# EAGLE design Mixer_Module (EAGLE 7.6.0)

## Sheet 1 of 4
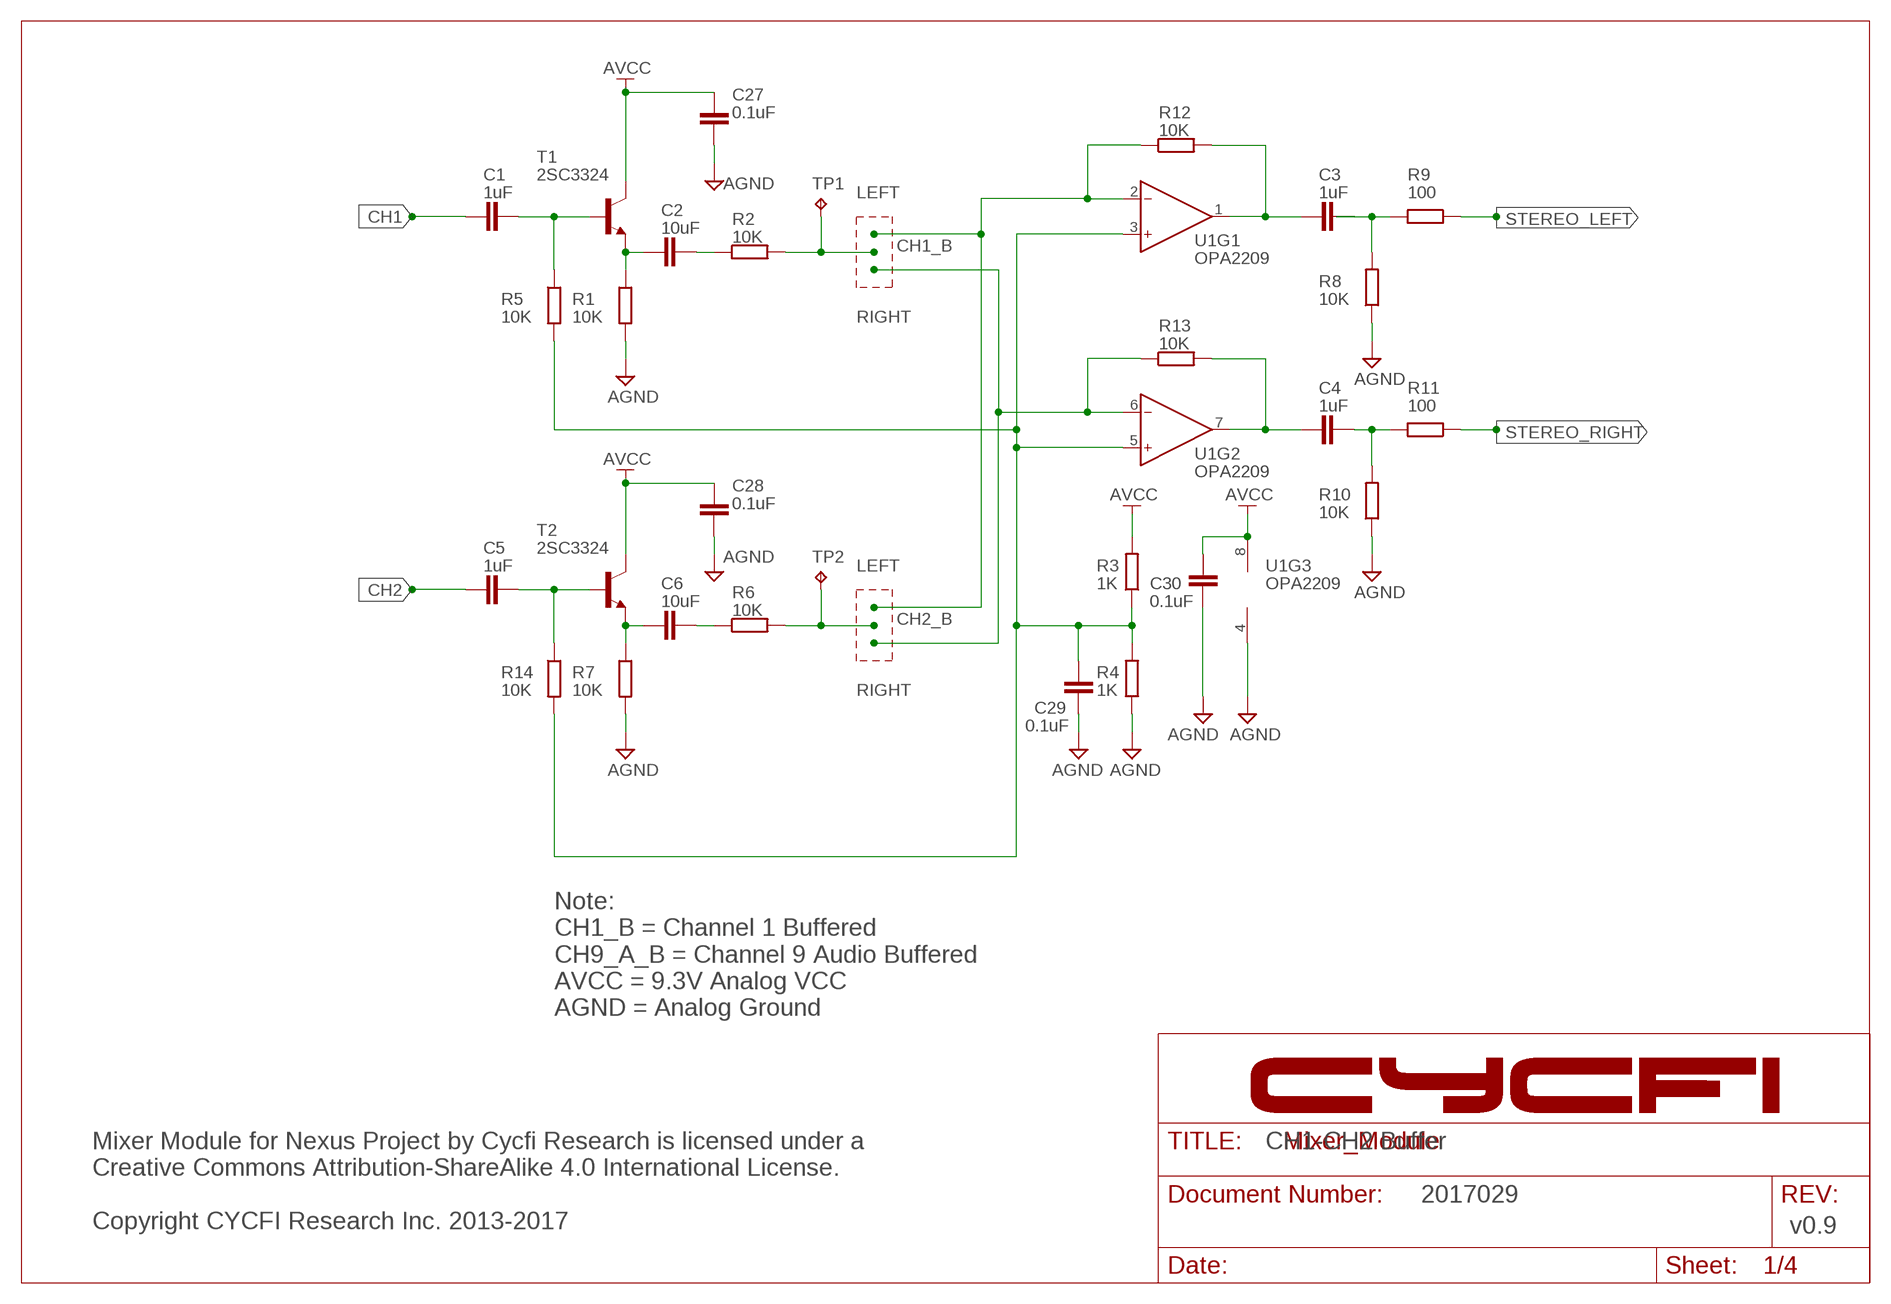
[diagram p0: schematic, sheet 1]

### Parts
C1  1uF  C-EUC0603  [C0603]
C2  10uF  C-EUC0603  [C0603]
C3  1uF  C-EUC0603  [C0603]
C4  1uF  C-EUC0603  [C0603]
C5  1uF  C-EUC0603  [C0603]
C6  10uF  C-EUC0603  [C0603]
C27  0.1uF  C-EUC0603  [C0603]
C28  0.1uF  C-EUC0603  [C0603]
C29  0.1uF  C-EUC0603  [C0603]
C30  0.1uF  C-EUC0603  [C0603]
R1  10K  R-EU_R0402  [R0402]
R2  10K  R-EU_R0402  [R0402]
R3  1K  R-EU_R0402  [R0402]
R4  1K  R-EU_R0402  [R0402]
R5  10K  R-EU_R0402  [R0402]
R6  10K  R-EU_R0402  [R0402]
R7  10K  R-EU_R0402  [R0402]
R8  10K  R-EU_R0402  [R0402]
R9  100  R-EU_R0402  [R0402]
R10  10K  R-EU_R0402  [R0402]
R11  100  R-EU_R0402  [R0402]
R12  10K  R-EU_R0402  [R0402]
R13  10K  R-EU_R0402  [R0402]
R14  10K  R-EU_R0402  [R0402]
T1  2SC3324  [SOT23]
T2  2SC3324  [SOT23]
TP1  TPB1,27  [B1,27]
TP2  TPB1,27  [B1,27]
U1  OPA2209  [MSOP8]

### Nets
AGND: C27.1 C28.1 C29.1 C30.1 R1.2 R4.1 R7.2 R8.1 R10.1 U1.4(V-) ; also sheet 2,3,4
AVCC: C27.2 C28.2 C30.2 R3.2 T1.3(C) T2.3(C) U1.8(V+) ; also sheet 2,3
CH1: C1.1 ; also sheet 4
CH1_B: R2.2 TP1.TP ; also sheet 4
CH2: C5.1 ; also sheet 4
CH2_B: R6.2 TP2.TP ; also sheet 4
LEFT: R12.1 U1.2(IN-) ; also sheet 2,4
N$1: C6.1 R7.1 T2.2(E)
N$2: C2.1 R1.1 T1.2(E)
N$3: C1.2 R5.1 T1.1(B)
N$4: C3.2 R8.2 R9.2
N$5: C3.1 R12.2 U1.1(OUT)
N$6: C4.1 R13.2 U1.7(OUT)
N$7: C2.2 R2.1
N$8: C4.2 R10.2 R11.2
N$9: C6.2 R6.1
N$10: C5.2 R14.1 T2.1(B)
N$11: C29.2 R3.1 R4.2 R5.2 R14.2 U1.3(IN+) U1.5(IN+)
RIGHT: R13.1 U1.6(IN-) ; also sheet 2,4
STEREO_LEFT: R9.1 ; also sheet 4
STEREO_RIGHT: R11.1 ; also sheet 4

### Notes on the sheet
- Note:
  CH1_B = Channel 1 Buffered
  CH9_A_B = Channel 9 Audio Buffered
  AVCC = 9.3V Analog VCC
  AGND = Analog Ground
- CH1-CH2 Buffer
- 2017029
- Mixer Module for Nexus Project by Cycfi Research is licensed under a 
  Creative Commons Attribution-ShareAlike 4.0 International License. 
  
  Copyright CYCFI Research Inc. 2013-2017
- v0.9

## Sheet 2 of 4
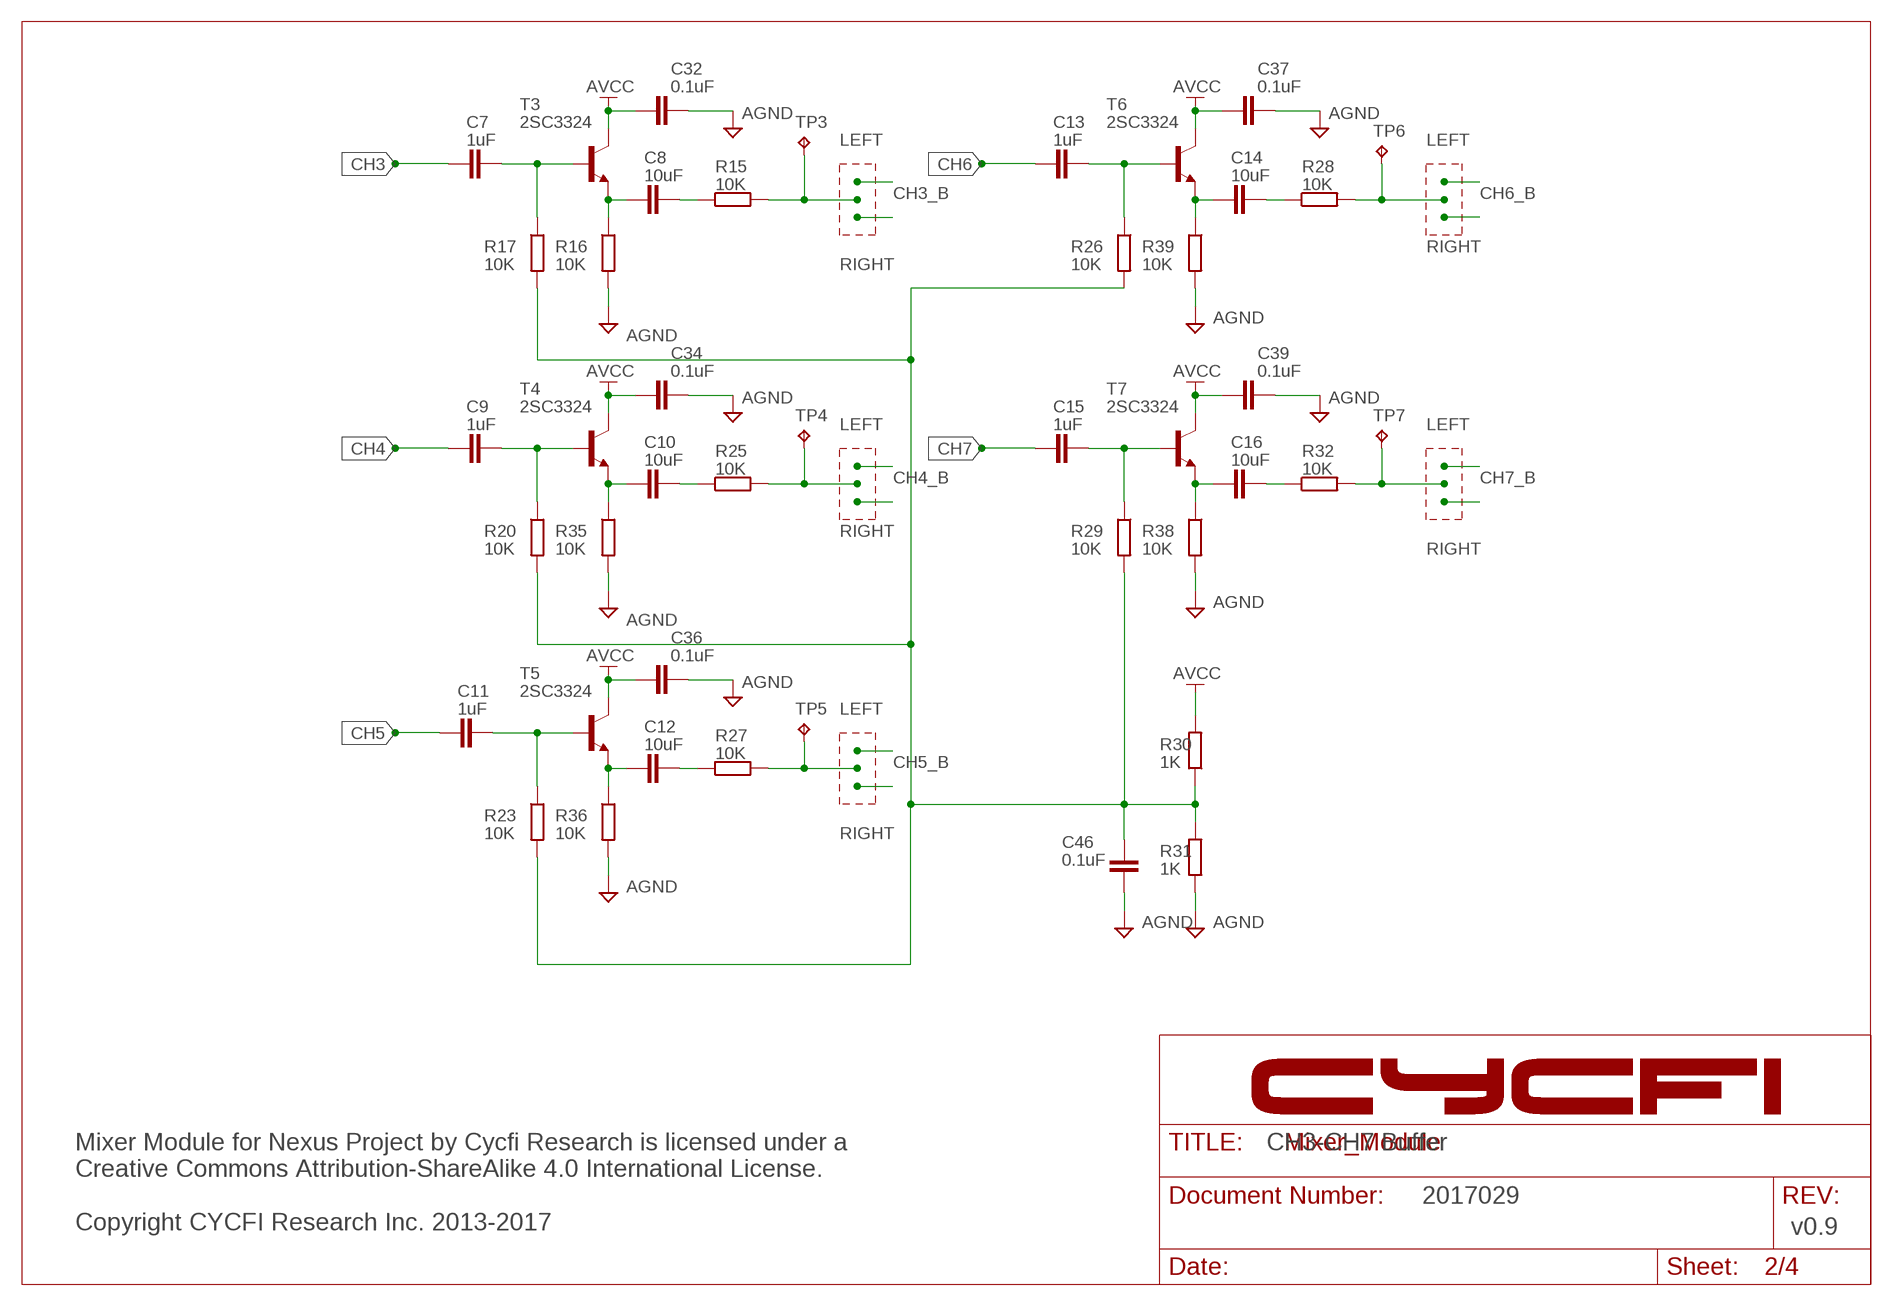
[diagram p1: schematic, sheet 2, part 1 of 2]
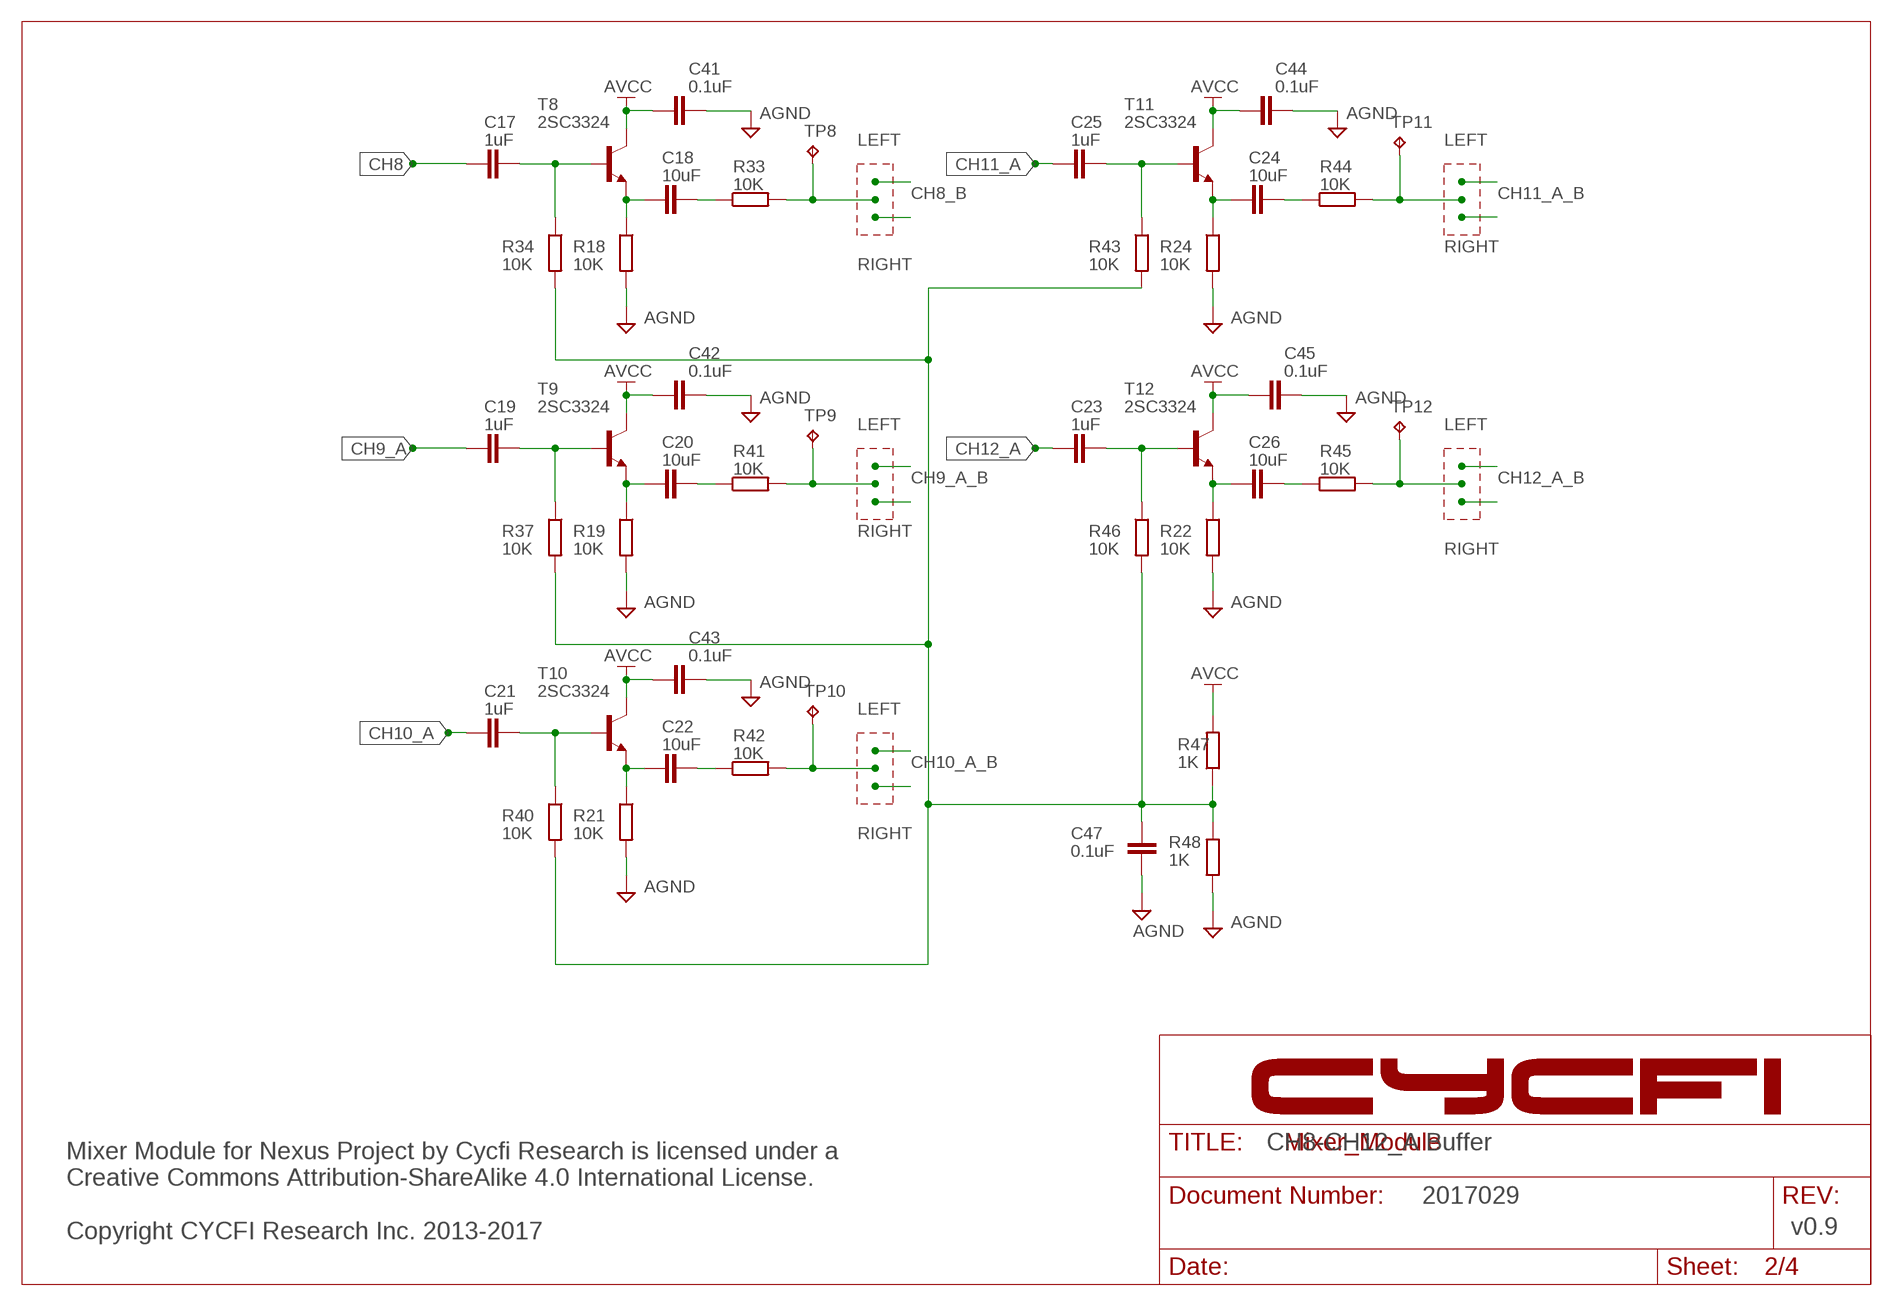
[diagram p2: schematic, sheet 2, part 2 of 2]

### Parts
C7  1uF  C-EUC0603  [C0603]
C8  10uF  C-EUC0603  [C0603]
C9  1uF  C-EUC0603  [C0603]
C10  10uF  C-EUC0603  [C0603]
C11  1uF  C-EUC0603  [C0603]
C12  10uF  C-EUC0603  [C0603]
C13  1uF  C-EUC0603  [C0603]
C14  10uF  C-EUC0603  [C0603]
C15  1uF  C-EUC0603  [C0603]
C16  10uF  C-EUC0603  [C0603]
C17  1uF  C-EUC0603  [C0603]
C18  10uF  C-EUC0603  [C0603]
C19  1uF  C-EUC0603  [C0603]
C20  10uF  C-EUC0603  [C0603]
C21  1uF  C-EUC0603  [C0603]
C22  10uF  C-EUC0603  [C0603]
C23  1uF  C-EUC0603  [C0603]
C24  10uF  C-EUC0603  [C0603]
C25  1uF  C-EUC0603  [C0603]
C26  10uF  C-EUC0603  [C0603]
C32  0.1uF  C-EUC0603  [C0603]
C34  0.1uF  C-EUC0603  [C0603]
C36  0.1uF  C-EUC0603  [C0603]
C37  0.1uF  C-EUC0603  [C0603]
C39  0.1uF  C-EUC0603  [C0603]
C41  0.1uF  C-EUC0603  [C0603]
C42  0.1uF  C-EUC0603  [C0603]
C43  0.1uF  C-EUC0603  [C0603]
C44  0.1uF  C-EUC0603  [C0603]
C45  0.1uF  C-EUC0603  [C0603]
C46  0.1uF  C-EUC0603  [C0603]
C47  0.1uF  C-EUC0603  [C0603]
R15  10K  R-EU_R0402  [R0402]
R16  10K  R-EU_R0402  [R0402]
R17  10K  R-EU_R0402  [R0402]
R18  10K  R-EU_R0402  [R0402]
R19  10K  R-EU_R0402  [R0402]
R20  10K  R-EU_R0402  [R0402]
R21  10K  R-EU_R0402  [R0402]
R22  10K  R-EU_R0402  [R0402]
R23  10K  R-EU_R0402  [R0402]
R24  10K  R-EU_R0402  [R0402]
R25  10K  R-EU_R0402  [R0402]
R26  10K  R-EU_R0402  [R0402]
R27  10K  R-EU_R0402  [R0402]
R28  10K  R-EU_R0402  [R0402]
R29  10K  R-EU_R0402  [R0402]
R30  1K  R-EU_R0402  [R0402]
R31  1K  R-EU_R0402  [R0402]
R32  10K  R-EU_R0402  [R0402]
R33  10K  R-EU_R0402  [R0402]
R34  10K  R-EU_R0402  [R0402]
R35  10K  R-EU_R0402  [R0402]
R36  10K  R-EU_R0402  [R0402]
R37  10K  R-EU_R0402  [R0402]
R38  10K  R-EU_R0402  [R0402]
R39  10K  R-EU_R0402  [R0402]
R40  10K  R-EU_R0402  [R0402]
R41  10K  R-EU_R0402  [R0402]
R42  10K  R-EU_R0402  [R0402]
R43  10K  R-EU_R0402  [R0402]
R44  10K  R-EU_R0402  [R0402]
R45  10K  R-EU_R0402  [R0402]
R46  10K  R-EU_R0402  [R0402]
R47  1K  R-EU_R0402  [R0402]
R48  1K  R-EU_R0402  [R0402]
T3  2SC3324  [SOT23]
T4  2SC3324  [SOT23]
T5  2SC3324  [SOT23]
T6  2SC3324  [SOT23]
T7  2SC3324  [SOT23]
T8  2SC3324  [SOT23]
T9  2SC3324  [SOT23]
T10  2SC3324  [SOT23]
T11  2SC3324  [SOT23]
T12  2SC3324  [SOT23]
TP3  TPB1,27  [B1,27]
TP4  TPB1,27  [B1,27]
TP5  TPB1,27  [B1,27]
TP6  TPB1,27  [B1,27]
TP7  TPB1,27  [B1,27]
TP8  TPB1,27  [B1,27]
TP9  TPB1,27  [B1,27]
TP10  TPB1,27  [B1,27]
TP11  TPB1,27  [B1,27]
TP12  TPB1,27  [B1,27]

### Nets
AGND: C32.1 C34.1 C36.1 C37.1 C39.1 C41.1 C42.1 C43.1 C44.1 C45.1 C46.1 C47.1 R16.2 R18.2 R19.2 R21.2 R22.2 R24.2 R31.1 R35.2 R36.2 R38.2 R39.2 R48.1 ; also sheet 1,3,4
AVCC: C32.2 C34.2 C36.2 C37.2 C39.2 C41.2 C42.2 C43.2 C44.2 C45.2 R30.2 R47.2 T3.3(C) T4.3(C) T5.3(C) T6.3(C) T7.3(C) T8.3(C) T9.3(C) T10.3(C) T11.3(C) T12.3(C) ; also sheet 1,3
CH3: C7.1 ; also sheet 4
CH3_B: R15.2 TP3.TP ; also sheet 4
CH4: C9.1 ; also sheet 4
CH4_B: R25.2 TP4.TP ; also sheet 4
CH5: C11.1 ; also sheet 4
CH5_B: R27.2 TP5.TP ; also sheet 4
CH6: C13.1 ; also sheet 4
CH6_B: R28.2 TP6.TP ; also sheet 4
CH7: C15.1 ; also sheet 4
CH7_B: R32.2 TP7.TP ; also sheet 4
CH8: C17.1 ; also sheet 4
CH8_B: R33.2 TP8.TP ; also sheet 4
CH9_A: C19.1 ; also sheet 4
CH9_A_B: R41.2 TP9.TP ; also sheet 4
CH10_A: C21.1 ; also sheet 4
CH10_A_B: R42.2 TP10.TP ; also sheet 4
CH11_A: C25.1 ; also sheet 4
CH11_A_B: R44.2 TP11.TP ; also sheet 4
CH12_A: C23.1 ; also sheet 4
CH12_A_B: R45.2 TP12.TP ; also sheet 4
N$12: C18.1 R18.1 T8.2(E)
N$13: C18.2 R33.1
N$14: C8.1 R16.1 T3.2(E)
N$15: C8.2 R15.1
N$16: C7.2 R17.1 T3.1(B)
N$18: C10.1 R35.1 T4.2(E)
N$19: C10.2 R25.1
N$20: C9.2 R20.1 T4.1(B)
N$22: C12.1 R36.1 T5.2(E)
N$23: C12.2 R27.1
N$24: C11.2 R23.1 T5.1(B)
N$26: C14.1 R39.1 T6.2(E)
N$27: C14.2 R28.1
N$28: C13.2 R26.1 T6.1(B)
N$30: C16.1 R38.1 T7.2(E)
N$31: C16.2 R32.1
N$32: C15.2 R29.1 T7.1(B)
N$34: C46.2 R17.2 R20.2 R23.2 R26.2 R29.2 R30.1 R31.2
N$35: C17.2 R34.1 T8.1(B)
N$36: C20.1 R19.1 T9.2(E)
N$37: C20.2 R41.1
N$38: C19.2 R37.1 T9.1(B)
N$40: C22.1 R21.1 T10.2(E)
N$41: C22.2 R42.1
N$42: C21.2 R40.1 T10.1(B)
N$44: C24.1 R24.1 T11.2(E)
N$45: C24.2 R44.1
N$46: C25.2 R43.1 T11.1(B)
N$48: C26.1 R22.1 T12.2(E)
N$49: C26.2 R45.1
N$50: C23.2 R46.1 T12.1(B)
N$52: C47.2 R34.2 R37.2 R40.2 R43.2 R46.2 R47.1 R48.2

### Notes on the sheet
- CH3-CH7 Buffer | CH8-CH12_A Buffer
- 2017029 | 2017029
- Mixer Module for Nexus Project by Cycfi Research is licensed under a 
  Creative Commons Attribution-ShareAlike 4.0 International License. 
  
  Copyright CYCFI Research Inc. 2013-2017
- v0.9 | v0.9
- Mixer Module for Nexus Project by Cycfi Research is licensed under a 
  Creative Commons Attribution-ShareAlike 4.0 International License. 
  
  Copyright CYCFI Research Inc. 2013-2017

## Sheet 3 of 4
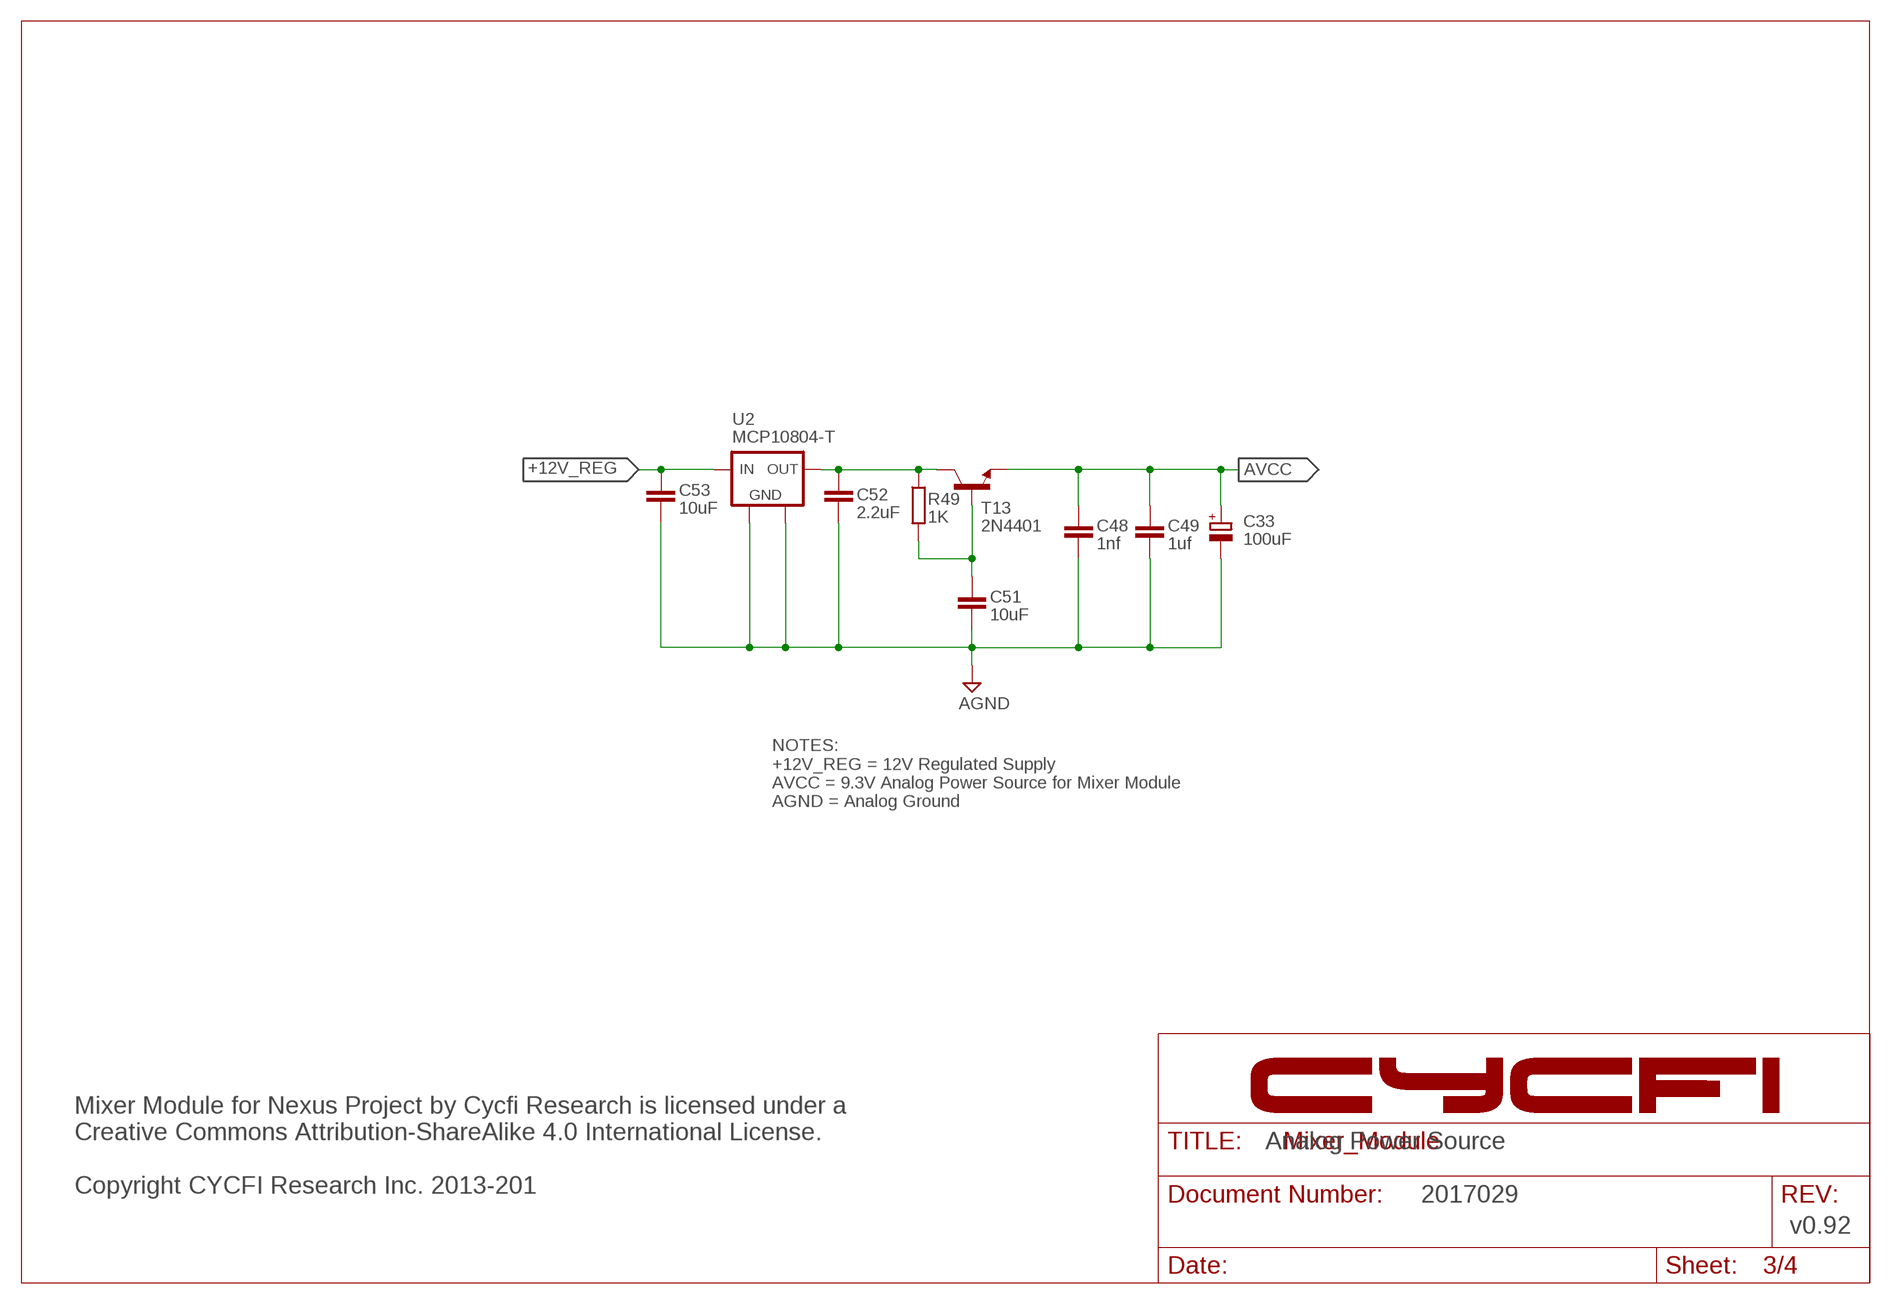
[diagram p3: schematic, sheet 3]

### Parts
C33  100uF  CPOL-EU153CLV-0505  [153CLV-0505]
C48  1nf  C-EUC0603  [C0603]
C49  1uf  C-EUC0603  [C0603]
C51  10uF  C-EUC0805  [C0805]
C52  2.2uF  C-EUC0805  [C0805]
C53  10uF  C-EUC0805  [C0805]
R49  1K  R-EU_R0402  [R0402]
T13  2N4401  TRAN-MMBT2222A  [SOT23-3]
U2  MCP10804-T  L78LXX  [SOT89]

### Nets
+12V_REG: C53.1 U2.3(OUT) ; also sheet 4
AGND: C33.- C48.2 C49.2 C51.2 C52.2 C53.2 U2.2(GND) U2.2@1(GND1) ; supply symbol labelled GND ; also sheet 1,2,4
AVCC: C33.+ C48.1 C49.1 T13.2(E) ; also sheet 1,2
N$29: C51.1 R49.2 T13.1(B)
N$33: C52.1 R49.1 T13.3(C) U2.1(IN)

### Notes on the sheet
- NOTES:
  +12V_REG = 12V Regulated Supply
  AVCC = 9.3V Analog Power Source for Mixer Module
  AGND = Analog Ground
- Analog Power Source
- Mixer Module for Nexus Project by Cycfi Research is licensed under a 
  Creative Commons Attribution-ShareAlike 4.0 International License. 
  
  Copyright CYCFI Research Inc. 2013-201
- 2017029
- v0.92

## Sheet 4 of 4
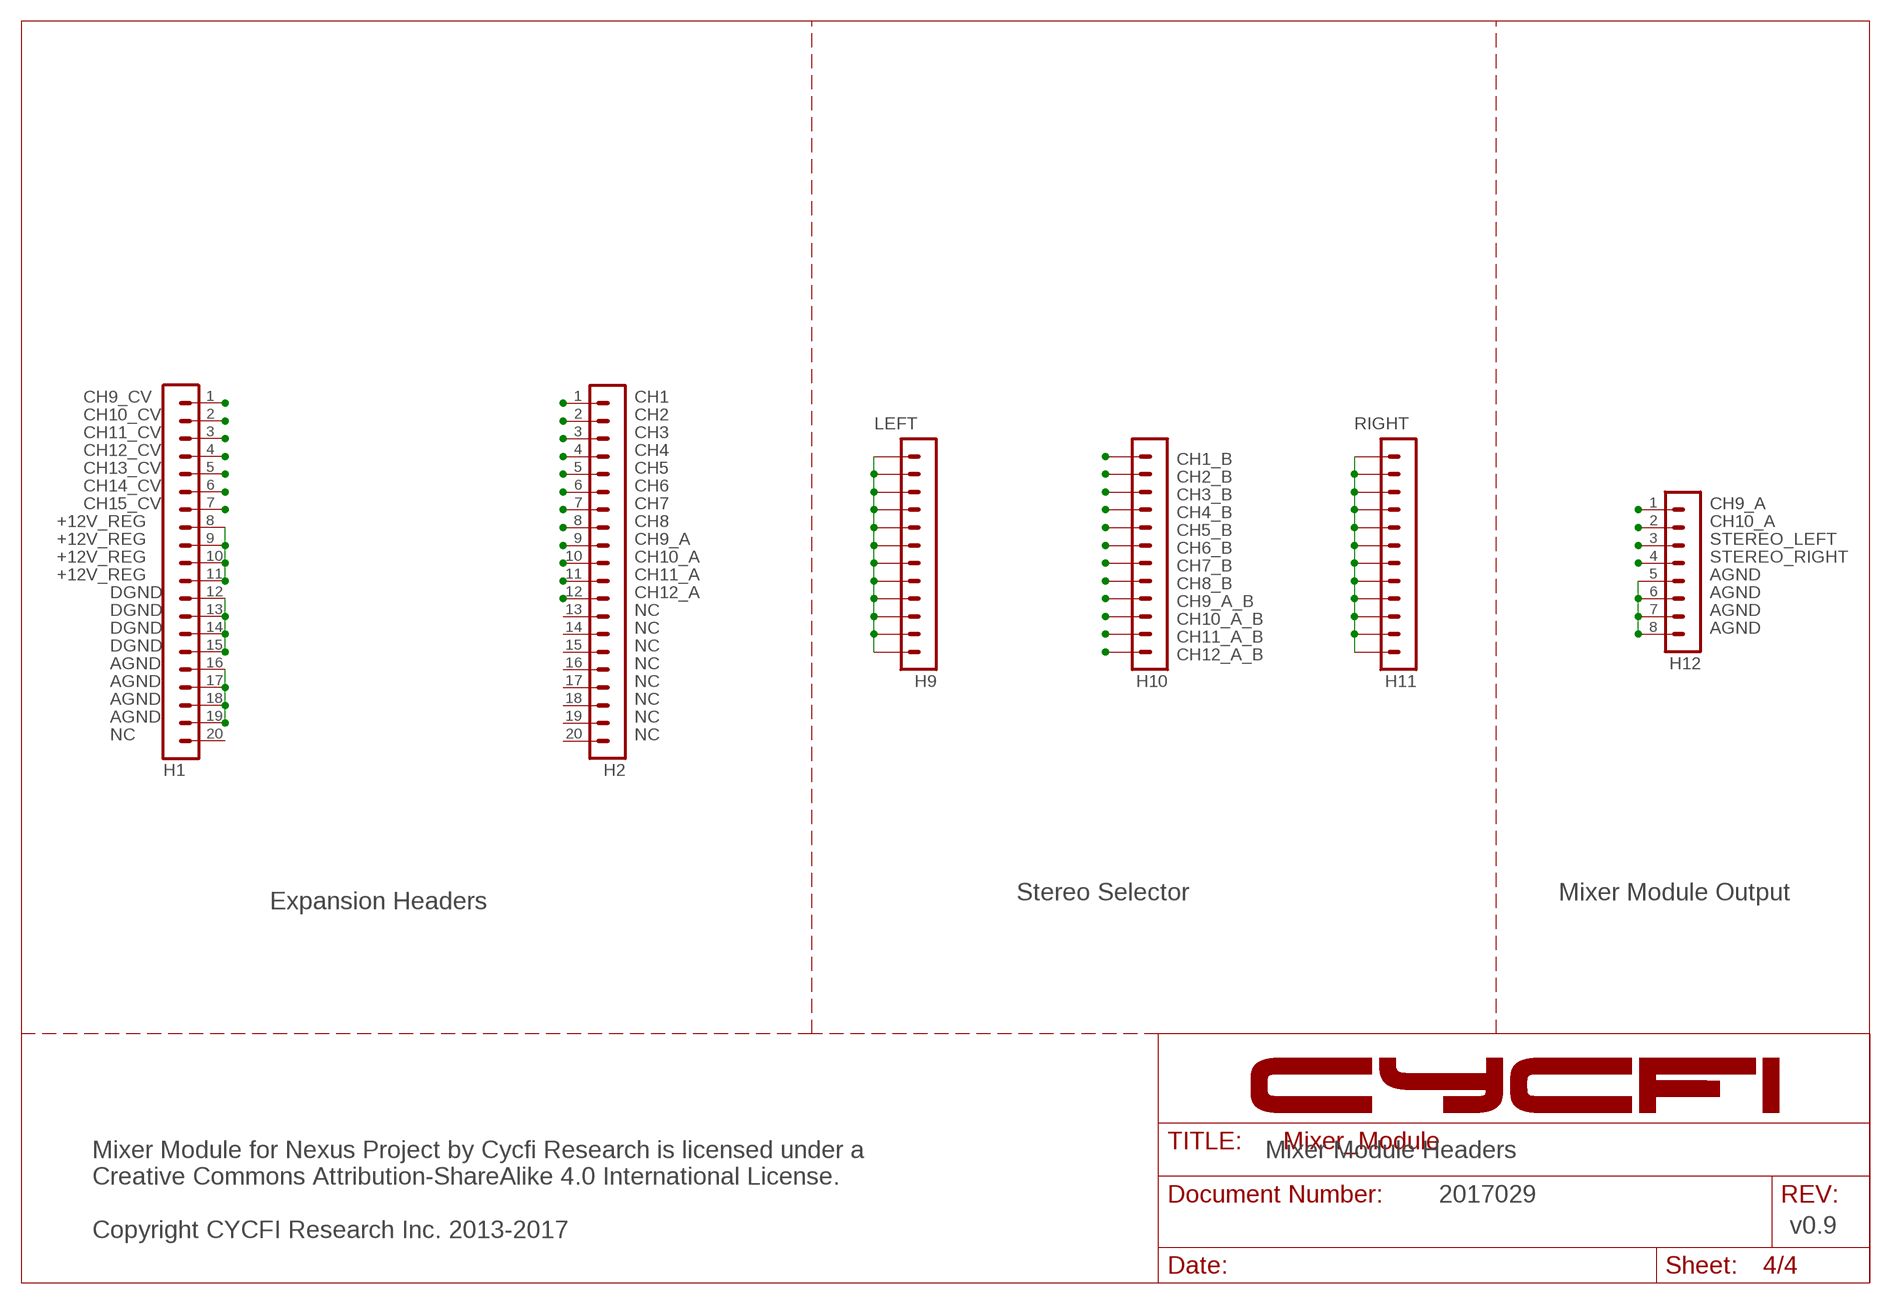
[diagram p4: schematic, sheet 4]

### Parts
H1  MA20-1  [MA20-1]
H2  MA20-1  [MA20-1]
H9  12PIN-TH-2.54MM  [12P]
H10  12PIN-TH-2.54MM  [12P]
H11  12PIN-TH-2.54MM  [12P]
H12  MA08-1  [MA08-1]

### Nets
+12V_REG: H1.8 H1.9 H1.10 H1.11 ; also sheet 3
AGND: H1.16 H1.17 H1.18 H1.19 H12.5 H12.6 H12.7 H12.8 ; also sheet 1,2,3
CH1: H2.1 ; also sheet 1
CH1_B: H10.1 ; also sheet 1
CH2: H2.2 ; also sheet 1
CH2_B: H10.2 ; also sheet 1
CH3: H2.3 ; also sheet 2
CH3_B: H10.3 ; also sheet 2
CH4: H2.4 ; also sheet 2
CH4_B: H10.4 ; also sheet 2
CH5: H2.5 ; also sheet 2
CH5_B: H10.5 ; also sheet 2
CH6: H2.6 ; also sheet 2
CH6_B: H10.6 ; also sheet 2
CH7: H2.7 ; also sheet 2
CH7_B: H10.7 ; also sheet 2
CH8: H2.8 ; also sheet 2
CH8_B: H10.8 ; also sheet 2
CH9_A: H2.9 H12.1 ; also sheet 2
CH9_A_B: H10.9 ; also sheet 2
CH10_A: H2.10 H12.2 ; also sheet 2
CH10_A_B: H10.10 ; also sheet 2
CH11_A: H2.11 ; also sheet 2
CH11_A_B: H10.11 ; also sheet 2
CH12_A: H2.12 ; also sheet 2
CH12_A_B: H10.12 ; also sheet 2
CH15_CV: H1.7
DGND: H1.12 H1.13 H1.14 H1.15
LEFT: H9.1 H9.2 H9.3 H9.4 H9.5 H9.6 H9.7 H9.8 H9.9 H9.10 H9.11 H9.12 ; also sheet 1,2
N$17: H1.1
N$39: H1.2
N$43: H1.3
N$47: H1.4
N$51: H1.5
N$53: H1.6
RIGHT: H11.1 H11.2 H11.3 H11.4 H11.5 H11.6 H11.7 H11.8 H11.9 H11.10 H11.11 H11.12 ; also sheet 1,2
STEREO_LEFT: H12.3 ; also sheet 1
STEREO_RIGHT: H12.4 ; also sheet 1
Unconnected: H1.20 H2.13 H2.14 H2.15 H2.16 H2.17 H2.18 H2.19 H2.20

### Notes on the sheet
- CH9_CV
- CH10_CV
- CH11_CV
- CH12_CV
- CH13_CV
- CH14_CV
- NC
- NC
- NC
- NC
- NC
- NC
- NC
- NC | NC
- Stereo Selector | Mixer Module Output
- Expansion Headers
- Mixer Module Headers
- 2017029
- v0.9
- Mixer Module for Nexus Project by Cycfi Research is licensed under a 
  Creative Commons Attribution-ShareAlike 4.0 International License. 
  
  Copyright CYCFI Research Inc. 2013-2017

## Library data of the parts
C1-C30 C32 C34 C36 C37 C39 C41-C49 C51-C53 = resistor:C-EU: CAPACITOR, European symbol
C33 = resistor:CPOL-EU: POLARIZED CAPACITOR, European symbol
H1 H2 = con-lstb:MA20-1: PIN HEADER; OC_FARNELL: unknown; OC_NEWARK: unknown
H9-H11 = CYCFI_Con:12PIN-TH-2.54MM
H12 = con-lstb:MA08-1: PIN HEADER; OC_FARNELL: unknown; OC_NEWARK: unknown
R1-R49 = resistor:R-EU_: RESISTOR, European symbol
T1-T12 = CYCFI_semicon:2SC3324
T13 = Cycfi:TRAN-MMBT2222A
TP1-TP12 = testpad:TP: Test pad
U1 = CYCFI_semicon:OPA2209
U2 = CYCFI_Power:L78LXX

## Board
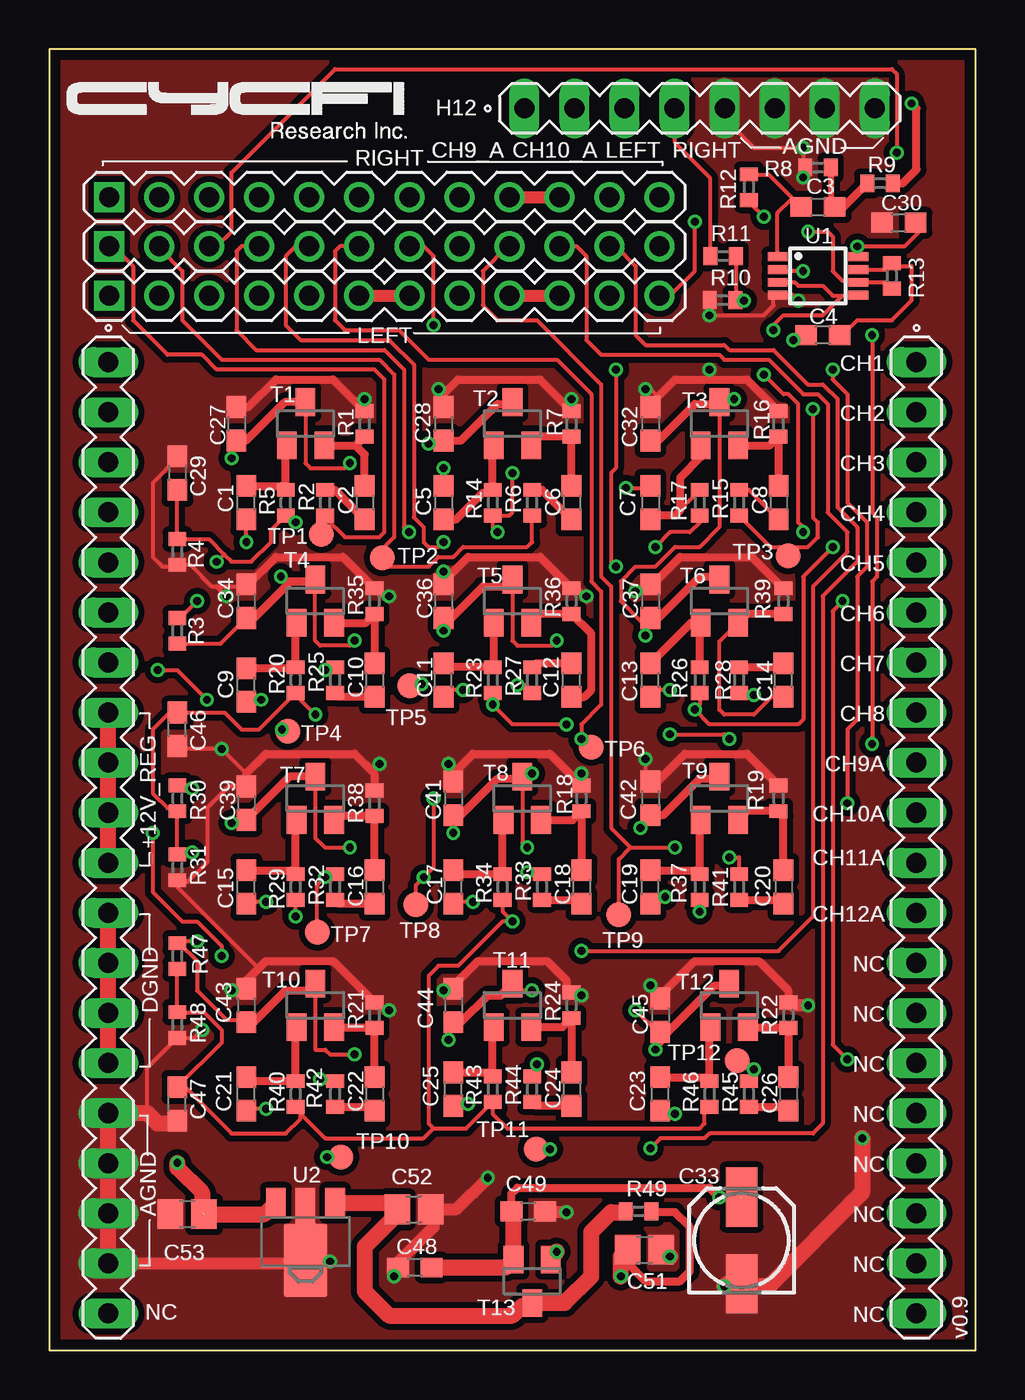
[diagram p5: board, top side]
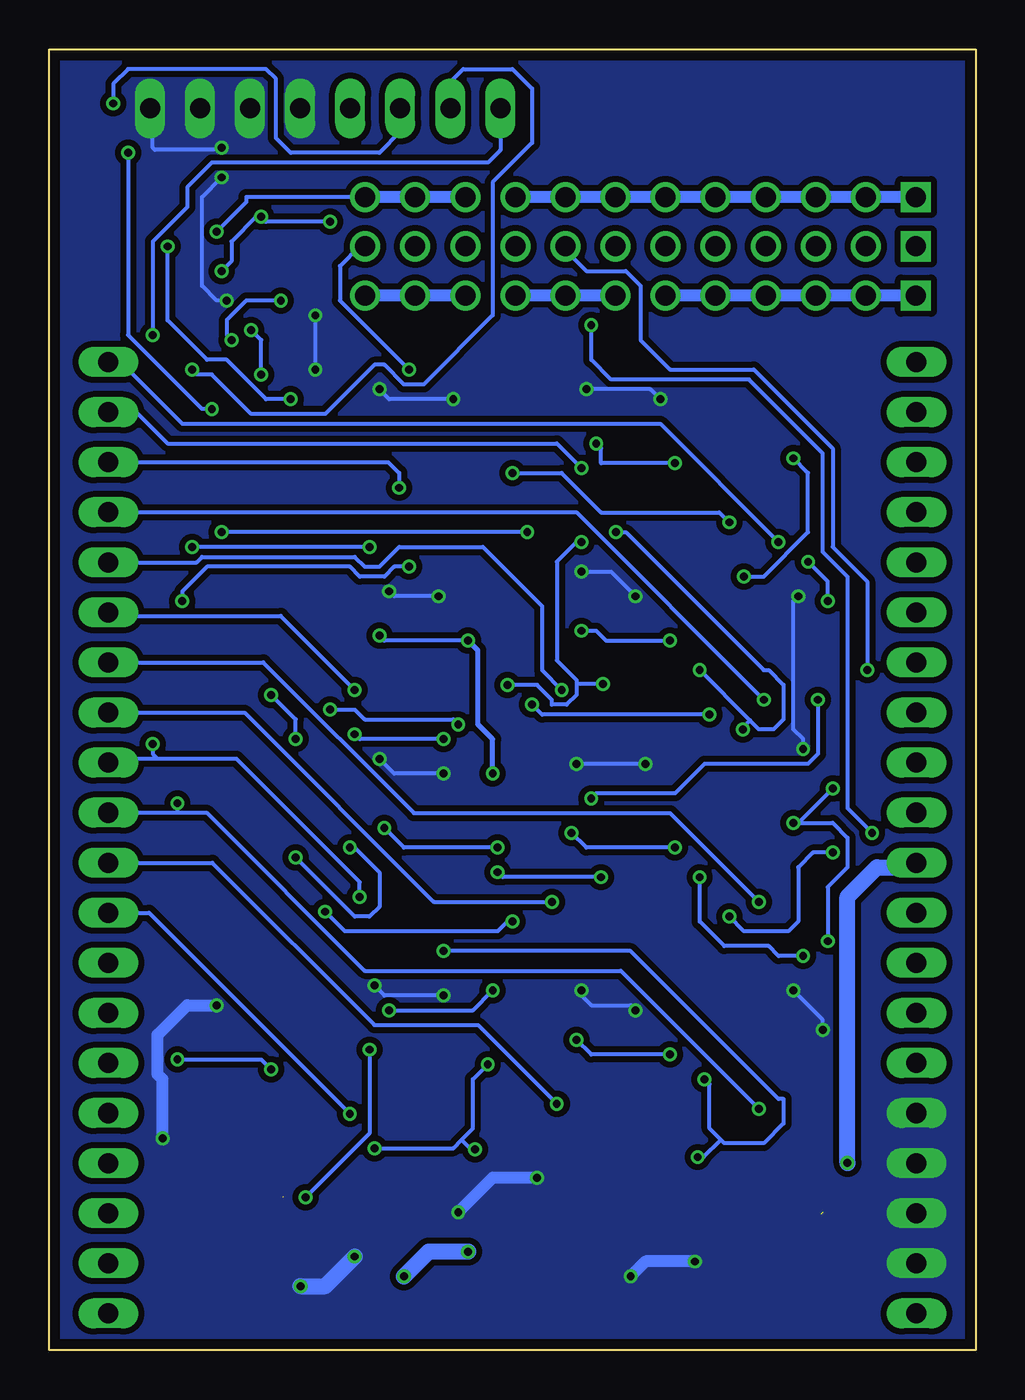
[diagram p6: board, bottom side, seen from below]

Size 47 x 66 mm. Coordinates in mm from the lower left corner, seen from the top.
Outline: 0,0 47,0 47,66 0,66 0,0
Copper layers (1*16): Top 0.035mm / dielectric 1.6mm / Bottom 0.035mm
Design rules "Elecrow_2-layer_PCB_eagle_rule": minimum track width 6mil, minimum drill 12mil, track to track 6mil, track to pad 8mil, pad to pad 12mil, via to via 12mil, smd to smd 0mil, copper to edge 20mil, drill to drill 10mil, minimum pad ring 6mil, minimum via ring 6mil, stop-mask expansion 0mil, vias tented up to drill 100mil, thermal gap 10mil

### Footprints (pad centres in the part's own frame; a part is rotated, then mirrored left to right if it is on the bottom)
C0603 = smd 1.1 x 1: 1 -0.85,0; 2 0.85,0
153CLV-0505 = smd 3 x 1.6: + 2.2,0; - -2.2,0
C0805 = smd 1.3 x 1.5: 1 -0.85,0; 2 0.85,0
MA20-1 = drill 1.016 long: 1 -24.13,0; 2 -21.59,0; 3 -19.05,0; 4 -16.51,0; 5 -13.97,0; 6 -11.43,0; 7 -8.89,0; 8 -6.35,0; 9 -3.81,0; 10 -1.27,0; 11 1.27,0; 12 3.81,0; 13 6.35,0; 14 8.89,0; 15 11.43,0; 16 13.97,0; 17 16.51,0; 18 19.05,0; 19 21.59,0; 20 24.13,0
12P = drill 1.016 square: 1 -13.97,0 | drill 1.016: 2 -11.43,0; 3 -8.89,0; 4 -6.35,0; 5 -3.81,0; 6 -1.27,0; 7 1.27,0; 8 3.81,0; 9 6.35,0; 10 8.89,0; 11 11.43,0; 12 13.97,0
MA08-1 = drill 1.016 long: 1 -8.89,0; 2 -6.35,0; 3 -3.81,0; 4 -1.27,0; 5 1.27,0; 6 3.81,0; 7 6.35,0; 8 8.89,0
R0402 = smd 0.7 x 0.9: 1 -0.65,0; 2 0.65,0
SOT23 = smd 1 x 1.4: 1 -0.95,-1.1; 2 0.95,-1.1; 3 0,1.1
SOT23-3 = smd 1 x 1.4: 1 -0.95,-1.1; 2 0.95,-1.1; 3 0,1.1
B1,27 = smd 1.27 x 1.27: TP 0,0
MSOP8 = smd 0.45 x 1: 1 -0.975,-2.05; 2 -0.325,-2.05; 3 0.325,-2.05; 4 0.975,-2.05; 5 0.975,2.05; 6 0.325,2.05; 7 -0.325,2.05; 8 -0.975,2.05
SOT89 = smd 1 x 1.5: 1 -1.499,-1.981; 3 1.499,-1.981 | smd 1 x 2: 2 0,-1.727 | smd 2.2 x 3.7: 2@1 0,0.94

### Placement (x,y rotation side)
C1  10,43 90 top
C2  16,43 270 top
C3  39,58 0 top
C4  39.25,51.5 180 top
C5  20,43 270 top
C6  26.5,43 270 top
C7  30.5,43 270 top
C8  37,43 270 top
C9  10,33.75 90 top
C10  16.5,34 270 top
C11  20,34 90 top
C12  26.5,34 90 top
C13  30.5,34 90 top
C14  37.25,34 90 top
C15  10,23.5 90 top
C16  16.5,23.5 270 top
C17  20.5,23.5 90 top
C18  27,23.5 270 top
C19  30.5,23.5 90 top
C20  37.25,23.5 270 top
C21  10,13 90 top
C22  16.5,13 270 top
C23  31,13 90 top
C24  26.5,13.25 270 top
C25  20.5,13.25 90 top
C26  37.5,13 270 top
C27  9.5,47 270 top
C28  20,47 270 top
C29  6.5,44.5 270 top
C30  43.1,57.2 0 top
C32  30.5,47 270 top
C33  35.13,5.57 90 top
C34  10,38 270 top
C36  20,38 270 top
C37  30.5,38 270 top
C39  10,27.75 270 top
C41  20.5,28 270 top
C42  30.5,28 270 top
C43  10,17.5 270 top
C44  20.5,17.5 270 top
C45  31,17 270 top
C46  6.5,31.5 90 top
C47  6.5,12.5 90 top
C48  18.55,4.2 180 top
C49  24.3,7.05 0 top
C51  30.2,5.1 0 top
C52  18.5,7.15 0 top
C53  7,6.9 180 top
H1  3,26 270 top
H2  44,26 270 top
H9  17,53.5 0 top
H10  17,56 0 top
H11  17,58.5 0 top
H12  33,63 0 top
R1  16,47 90 top
R2  14,43 270 top
R3  6.5,36.5 270 top
R4  6.5,40.5 90 top
R5  12,43 270 top
R6  24.5,43 270 top
R7  26.5,47 90 top
R8  39,60 0 top
R9  42.15,59.2 180 top
R10  34.16,53.27 0 top
R11  34.19,55.51 0 top
R12  35.5,59 90 top
R13  42.75,54.5 90 top
R14  22.5,43 270 top
R15  35,43 270 top
R16  37,47 90 top
R17  33,43 270 top
R18  27,28 90 top
R19  37,28 90 top
R20  12.5,34 270 top
R21  16.5,17 90 top
R22  37.5,17 90 top
R23  22.5,34 270 top
R24  26.5,17.5 90 top
R25  14.5,34 90 top
R26  33,34 270 top
R27  24.5,34 270 top
R28  35,34 270 top
R29  12.5,23.5 270 top
R30  6.5,28 90 top
R31  6.5,24.5 90 top
R32  14.5,23.5 90 top
R33  25,23.5 90 top
R34  23,23.5 270 top
R35  16.5,38 90 top
R36  26.5,38 90 top
R37  33,23.5 270 top
R38  16.5,27.75 90 top
R39  37.25,38 90 top
R40  12.5,13 270 top
R41  35,23.5 90 top
R42  14.5,13 90 top
R43  22.5,13.25 270 top
R44  24.5,13.25 90 top
R45  35.5,13 90 top
R46  33.5,13 270 top
R47  6.5,20 90 top
R48  6.5,16.5 90 top
R49  29.9,7.05 0 top
T1  13,47 0 top
T2  23.5,47 0 top
T3  34,47 0 top
T4  13.5,38 0 top
T5  23.5,38 0 top
T6  34,38 0 top
T7  13.5,28 0 top
T8  24,28 0 top
T9  34,28 0 top
T10  13.5,17.5 0 top
T11  23.5,17.5 0 top
T12  34.5,17.5 0 top
T13  24.5,3.5 180 top
TP1  13.8,41.4 0 top
TP2  16.9,40.2 0 top
TP3  37.5,40.3 0 top
TP4  12.1,31.4 0 top
TP5  18.3,33.7 0 top
TP6  27.5,30.6 0 top
TP7  13.6,21.2 0 top
TP8  18.6,22.6 0 top
TP9  28.9,22.1 0 top
TP10  14.8,9.8 0 top
TP11  24.7,10.2 0 top
TP12  34.9,14.7 0 top
U1  39,54.5 270 top
U2  13,5.5 180 top

### Tracks (layer width: path | path; a pad name or v marks a point on that pad's centre or on a via)
+12V_REG  (via drill 0.4)  (1 unrouted)
  Top 0.813: C53.1 10.92,6.9 U2.3 | H1.11 H1.10 H1.9 H1.8 | v6.5,9.5 6.5,9.25 7.75,8 7.75,7
  Bottom 0.813: v6.5,9.5 6.5,23 5,24.5 3.23,24.5 H1.11
AGND  (via drill 0.4)
  Top 0.203: 6.5,45.5 C29.1 6.5,45.25 5.25,44 5.25,40.25 5.75,39.75 6.4,39.75 R4.1 7.15,39.85 8.25,38.75 8.5,38.75 | 8.5,38.75 9.9,38.75 C34.1 | 10,29.25 v8.75,30.5 6.65,30.5 C46.1 | C39.1 9.1,28.6 8,27.5 8,24.75 7,23.75 6.6,23.75 R31.1 6.5,23.5 10.62,19.38 | v7.75,16.25 7.35,15.85 R48.1 4.97,14.32 4.97,12.03 | v9.25,18.25 9.9,18.25 C43.1 | 8.5,38.75 v9,38.25 | R24.2 26.65,18 v27,18 | v30.5,18.5 30.5,18.35 C45.1 | R10.1 33.51,52.74 33.75,52.5 | v38,53.25 37.73,53.53 U1.4 36.75,53.33 36.75,53 36.25,52.5 33.75,52.5 | 38.25,60.1 v38.25,61 35.75,61 34.27,62.48 H12.5 | 38.25,60.1 R8.1 | R18.2 v27,29.25 | v30.25,30 30.25,29.1 C42.1 | 16.5,29.25 16.5,29.5 v16.75,29.75 | v20.25,29.75 20.25,29.1 C41.1 | C36.1 v20,39.5 | v17.25,38.25 16.9,38.25 R35.2 | C44.1 20.1,18.35 v20,18.25 | v17.25,17.25 16.9,17.25 R21.2 | R36.2 26.85,38.65 v27.25,38.25 | v29.75,38.5 30.15,38.5 C37.1 | R7.2 v26.5,48.25 | v30.25,48.75 30.5,48.75 30.88,48.38 | R1.2 v16,48.25 | v19.75,48.75 20,48.5 | 33.75,52.5 v33.5,52.5 | v33.5,49.75 33.5,49.25 | v38.25,59.5 38.25,60.1
  Top 0.406: C27.1 10.1,47.85 11.5,49.25 14.4,49.25 R1.2 | C28.1 20,48.5 20.75,49.25 24.9,49.25 R7.2 | C32.1 30.5,48 30.88,48.38 31.75,49.25 33.5,49.25 35.4,49.25 R16.2 | C34.1 10.1,38.85 11.5,40.25 14.9,40.25 R35.2 | C36.1 20,39 21.25,40.25 24.9,40.25 R36.2 | C37.1 30.6,38.85 32,40.25 35.65,40.25 R39.2 | C39.1 10,29.25 11,30.25 15.5,30.25 16.5,29.25 R38.2 | C41.1 20.5,29.25 21.5,30.25 25.4,30.25 R18.2 | C42.1 30.85,28.85 32.25,30.25 35.4,30.25 R19.2 | C43.1 10,18.75 10.62,19.38 11,19.75 14.4,19.75 R21.2 | C44.1 20.5,18.5 21.75,19.75 25.25,19.75 26.25,18.75 26.25,18.4 R24.2 | C45.1 31,18 32.75,19.75 36,19.75 37.5,18.25 R22.2
  Top 0.61: H1.19 12.85,4.41 U2.2@1 | v38.5,17.5 37.65,17.5 R22.2 | U2.2@1 U2.2 | U2.2@1 14.19,4.56 v14.25,4.5 | v17.5,3.75 17.5,4 C48.2 17.7,4.45 19.5,6.25 19.5,7 C52.2 20.65,7.15 v22.25,8.75 | v26.25,7 25.2,7 C49.2
  Top 0.813: H1.19 H1.18 H1.17 H1.16 4.97,12.03 5.5,11.5 6.35,11.5 C47.1 | v41.25,10.75 41.25,8 36.5,3.25 35.25,3.25 C33.- 34.37,3.37 v34.25,3.25 | v31.5,4.75 31.4,4.75 C51.2
  Bottom 0.203: v7.75,16.25 7.75,16.75 v9.25,18.25 | v27,18 30,18 v30.5,18.5 | v38,53.25 38.5,53.25 39.25,54 39.25,58.5 v38.25,59.5 | v38.25,61 38.35,60.9 41.65,60.9 41.75,61 41.75,62.86 H12.8 | v27,29.25 29.5,29.25 v30.25,30 | v16.75,29.75 v20.25,29.75 | v20,39.5 18.5,39.5 v17.25,38.25 | v20,18.25 20,18 19.5,17.5 17.5,17.5 v17.25,17.25 | v27.25,38.25 29.5,38.25 v29.75,38.5 | v26.5,48.25 29.75,48.25 v30.25,48.75 | v16,48.25 16.5,48.75 v19.75,48.75 | v8.75,30.5 8.75,31 9.25,31.5 9.25,38 v9,38.25 | v33.5,52.5 v33.5,49.75
  Bottom 0.61: v41.25,10.75 41.25,13.75 41.5,14 41.5,16 40,17.5 v38.5,17.5 | v14.25,4.5 16.75,4.5 v17.5,3.75 | v22.25,8.75 24.5,8.75 v26.25,7
  Bottom 0.813: v34.25,3.25 33,3.25 v31.5,4.75
  pour Bottom (isolate 0.305, no thermals): 0,66 47,66 47,0 0,0
  pour Top (isolate 0.305, no thermals): 0,66 47,66 47,0 0,0
AVCC  (via drill 0.4)  (1 unrouted)
  Top 0.203: C34.2 8.7,35.85 R3.2 7.4,35.85 | v7.25,28.5 6.65,28.5 R30.2 | C39.2 9.4,26.9 v9.25,26.75 | v7.5,20.75 6.6,20.75 R47.2 6.6,20.65 7.5,19.75 7.5,18.25 9,16.75 9.9,16.75 C43.2 | T10.3 13.5,15.25 14,15.25 14.25,15 v15.5,15 | v20.25,15.75 20.25,16.4 C44.2 | C45.2 30.85,16.15 v29.75,17.25 | v24.5,18.25 23.85,18.25 T11.3 | 31.4,16.15 31.4,15.9 v30.75,15.25 | v34,7.75 35.11,7.75 | C36.2 v20,36.5 | v15.5,36 15.25,35.75 13.75,35.75 13.5,36 T4.3 11.9,39.1 v11.75,39.25 | T7.3 13.5,26 14,25.5 v15.25,25.5 | v20.5,26.25 C41.2 | T8.3 24,25.75 v24.25,25.5 | v30,26.5 30,26.65 C42.2 | T5.3 23.5,36 23.75,35.75 25.5,35.75 v25.75,36 | v30.25,36.25 30.25,36.9 C37.2 30.35,37 30,37 29,38 29,39 29.75,39.75 30.75,39.75 31.75,40.75 33,40.75 34,41.75 T3.3 34.6,48.1 v34.75,48.25 | T1.3 13,45 13.25,44.75 15,44.75 v15.25,45 | v19.25,46 19.85,46 C28.2 | U1.8 41,55.53 v41,56 43.4,56 44.1,56.7 44.1,57.05 C30.2 | C27.2 9.1,45.75 9.25,45.6 v9.25,45.25
  Top 0.254: T8.3 24.35,29.1 v24.5,29.25
  Top 0.406: T1.3 11.95,48.1 10,46.15 C27.2 | C28.2 20.9,46.15 22.75,48 23.4,48 T2.3 | C32.2 30.9,46.15 32.75,48 33.9,48 T3.3 | C34.2 10.4,37.15 12.25,39 13.4,39 T4.3 | C36.2 20.4,37.15 22,38.75 23.15,38.75 T5.3 | C37.2 30.9,37.15 33,39.25 33.85,39.25 T6.3 | T7.3 12.2,29.1 C39.2 | C41.2 20.9,27.15 22.75,29 23.9,29 T8.3 | C42.2 31.15,27.15 33,29 33.9,29 T9.3 | C43.2 10.4,16.65 12,18.25 13.15,18.25 T10.3 | C44.2 20.9,16.65 22.25,18 22.9,18 T11.3 | C45.2 31.4,16.15 33.75,18.5 34.4,18.5 T12.3 | C49.1 23.45,7.95 23.75,8.25 33.5,8.25 v34,7.75
  Top 0.813: C48.1 23.15,4.2 T13.2 23.55,6.95 C49.1
  Bottom 0.203: v9.25,26.75 9,26.75 | 9,26.75 v7.25,28.5 | 9,26.75 7.25,26.75 6.5,26 6.5,24.5 7.5,23.5 v7.5,20.75 | v15.5,15 19.5,15 v20.25,15.75 | v29.75,17.25 25.5,17.25 v24.5,18.25 | v30.75,15.25 30.75,11 v34,7.75 | v20,36.5 19.25,36.5 18.75,36 v15.5,36 | v15.25,25.5 19.75,25.5 v20.5,26.25 | v24.25,25.5 29,25.5 v30,26.5 | v25.75,36 30,36 v30.25,36.25 | v15.25,45 19,45 19,45.75 v19.25,46 | v34.75,48.25 36,48.25 38,50.25 39,50.25 41,52.25 v41,56 | v11.75,39.25 10.75,39.25 8.5,41.5 8.5,44.5 v9.25,45.25
  Bottom 0.254: v24.5,29.25 24.5,31 25.25,31.75 25.25,35.5 v25.75,36
CH1  (via drill 0.4)
  Top 0.203: v10,41 C1.1
  Bottom 0.203: H2.1 43.38,50.13 40.25,47 16,47 v10,41
CH1_B
  Top 0.203: H10.1 3.25,56 4.25,55 4.25,52.25 6,50.5 7.75,50.5 8.5,49.75 16.5,49.75 17,49.25 17,41.5 16.75,41.25 15,41.25 14,42.25 R2.2 13.8,42.15 TP1.TP
CH2  (via drill 0.4)
  Top 0.203: v20,44.75 C5.1
  Bottom 0.203: H2.2 42.59,47.59 41,46 21.25,46 v20,44.75
CH2_B
  Top 0.203: H10.2 5.57,55.93 6.75,54.75 6.75,52.25 8.75,50.25 16.75,50.25 17.5,49.5 17.5,41.25 16.68,40.42 | R6.2 24.5,41 24.25,40.75 21,40.75 20.5,40.25 19.75,40.25 19.25,39.75 16.75,39.75 16.5,40 16.5,40.25 16.68,40.42 | TP2.TP 16.68,40.42
CH3  (via drill 0.4)
  Top 0.203: v29.25,43.75 30.4,43.75 C7.1
  Bottom 0.203: H2.3 29.8,45.05 29.25,44.5 v29.25,43.75
CH3_B  (via drill 0.4)
  Top 0.203: R15.2 36.6,40.75 37.05,40.75 | H10.3 8.5,56 9.25,56.75 9.25,59.75 14.5,65 42.75,65 43,64.75 v43,60.75 | v38.75,47.75 38.75,42.25 39,42 39,41.25 38.5,40.75 37.05,40.75 | 37.05,40.75 TP3.TP
  Bottom 0.203: v43,60.75 43,51.5 39.25,47.75 v38.75,47.75
CH4  (via drill 0.4)
  Top 0.203: v10.75,33 10.1,33 C9.1
  Bottom 0.203: H2.4 20.26,42.51 v10.75,33
CH4_B  (via drill 0.4)
  Top 0.203: v14,34.5 14.35,34.5 R25.2 | v18.25,41.5 18,41.75 18,49.75 17,50.75 10.5,50.75 9.5,51.75 9.5,55.75 9.75,56 H10.4 | TP4.TP 11.9,31.4 v11.8,31.5
  Bottom 0.203: 11.45,31.95 11,31.5 10.25,31.5 9.75,32 9.75,33.75 10.5,34.5 10.75,34.5 17.75,41.5 v18.25,41.5 | 11.45,31.95 v14,34.5 | v11.8,31.5 11.8,31.6 11.45,31.95
CH5  (via drill 0.4)
  Top 0.203: v21,33.5 20.35,33.5 C11.1
  Bottom 0.203: H2.5 39.53,39.97 39.25,40.25 31.5,40.25 31,39.75 30.25,39.75 29.25,40.75 25,40.75 22,37.75 22,34.5 v21,33.5
CH5_B  (via drill 0.4)
  Top 0.203: v20,41 19.75,40.75 19.25,40.75 19,41 19,41.75 18.5,42.25 18.5,50 17.25,51.25 12.75,51.25 12,52 12,55.5 12.5,56 H10.5 | v23.75,33.75 24.1,33.75 R27.2 | TP5.TP 18.8,33.7 v18.9,33.8
  Bottom 0.203: v20,41 20.25,41 21.25,40 21.25,35 20.25,34 20.25,33.9 | 20.25,33.9 20.25,33.25 20.75,32.75 21.5,32.75 21.5,33 22.25,33.75 v23.75,33.75 | v18.9,33.8 20.15,33.8 20.25,33.9
CH6  (via drill 0.4)
  Top 0.203: v31.5,33.5 30.85,33.5 C13.1
  Bottom 0.203: v31.5,33.5 35.25,37.25 43,37.25 43.18,37.43 H2.6
CH6_B  (via drill 0.4)
  Top 0.203: v31.5,31.25 34.25,31.25 v34.5,31 | v35.75,33.25 35.1,33.25 R28.2 | H10.6 14.75,56 14.5,55.75 14.5,52.25 15,51.75 17.75,51.75 19.25,50.25 25.75,50.25 27.5,48.5 27.5,39 28,38.5 28,32.75 27,31.75 v27,31 27.4,30.6 TP6.TP
  Bottom 0.203: v27,31 31.25,31 v31.5,31.25 | v34.5,31 34.5,32 v35.75,33.25
CH7  (via drill 0.4)
  Top 0.203: v11,22.75 10.1,22.75 C15.1
  Bottom 0.203: H2.7 36.14,34.89 28.5,27.25 15.5,27.25 v11,22.75
CH7_B  (via drill 0.4)
  Top 0.203: H10.7 19,56 19.5,55.5 v19.5,52 | v5.25,26.25 5.25,23.25 6.75,21.75 7.5,21.75 8.75,20.5 v8.75,20 | R32.2 14.35,24 v14,24 13.6,23.6 TP7.TP
  Bottom 0.203: v5.25,26.25 6.5,27.5 6.5,39.25 7.75,40.5 7.75,45.5 11.5,49.25 18.5,49.25 19.5,50.25 v19.5,52 | v8.75,20 10,20 10.5,20.5 12.75,20.5 14,21.75 v14,24
CH8  (via drill 0.4)
  Top 0.203: v21.5,22.75 20.6,22.75 C17.1
  Bottom 0.203: H2.8 37.1,32.35 27.5,22.75 v21.5,22.75
CH8_B  (via drill 0.4)
  Top 0.203: v5.5,34.5 6.5,34.5 v8,33 | v19.5,28 19.5,24.5 v19,24 18.6,23.6 TP8.TP | v24.25,24.25 24.9,24.25 R33.2
  Bottom 0.203: H10.8 20.81,55.81 19.75,54.75 17.75,54.75 17,54 17,51.25 15.5,49.75 11.25,49.75 7.25,45.75 7.25,40.75 5.5,39 v5.5,34.5 | v8,33 8,30.25 8.5,29.75 13.75,29.75 15.25,28.25 19.25,28.25 v19.5,28 | v19,24 24,24 v24.25,24.25
CH9_A  (via drill 0.4)
  Top 0.203: C19.1 30.6,22.75 31,22.75 v31.25,23 | v41.75,51.5 41.75,42.5 42,42.25 42,39.25 41.75,39 v41.75,30.75
  Bottom 0.203: 41.5,30 37.5,30 31.25,23.75 v31.25,23 | 41.5,30 43.81,30 H2.9 | H12.1 24.11,60.89 24.75,60.25 38.75,60.25 40,59 40,58 41.75,56.25 v41.75,51.5 | v41.75,30.75 41.75,30.25 41.5,30
CH9_A_B  (via drill 0.4)
  Top 0.203: 29.5,25.5 28.5,26.5 28.5,38.75 28,39.25 28,49 24.75,52.25 22.75,52.25 22,53 22,54.75 23.25,56 H10.9 | 29.5,25.5 v31.75,25.5 | v34.5,25 35,25 R41.2 | TP9.TP 28.9,24.9 29.5,25.5
  Bottom 0.203: v31.75,25.5 31.5,25.5 30.25,24.25 30.25,22.5 30.75,22 31.5,22 v34.5,25
CH10_A  (via drill 0.4)
  Top 0.203: v11,12.25 10.1,12.25 C21.1 | v40.5,27.75 40.5,31.5 41,32 41,39.25 41.5,39.75 41.5,42 40.5,43 40.5,48.5 39.75,49.25 v39.75,49.75
  Bottom 0.203: H2.10 40.5,27.27 | 40.5,27.27 39.02,27.27 31,19.25 18,19.25 v11,12.25 | H12.2 26.65,64.35 26,65 23.5,65 22.5,64 22.5,61.25 24.5,59.25 24.5,52.5 28,49 29,49 30,50 30.5,50 33,47.5 36.75,47.5 38.75,49.5 39.5,49.5 v39.75,49.75 | v40.5,27.75 40.5,27.27
CH10_A_B  (via drill 0.4)
  Top 0.203: H10.10 26.75,56 27.25,55.5 27.25,51.25 28,50.5 34,50.5 34.25,50.25 36.5,50.25 38.25,48.5 39,48.5 39.5,48 39.5,42.5 40.5,41.5 40.5,40.5 38.75,38.75 38.75,22 37,20.25 v27,20.25 | v13.75,13.75 14.4,13.75 R42.2 | TP10.TP v14.1,9.8
  Bottom 0.203: 12.93,10.68 12.75,10.5 10.75,10.5 9.75,11.5 9.75,12.75 10,12.75 17.5,20.25 v27,20.25 | 12.93,10.68 13.5,11.25 13.5,13.5 v13.75,13.75 | v14.1,9.8 13.8,9.8 12.93,10.68
CH11_A  (via drill 0.4)
  Top 0.203: v21.25,12.5 20.6,12.5 C25.1
  Bottom 0.203: H2.11 38.73,24.73 30.5,16.5 25.25,16.5 v21.25,12.5
CH11_A_B  (via drill 0.4)
  Top 0.203: H10.11 28.75,56 29.75,55 29.75,51.5 30.25,51 34.25,51 34.5,50.75 36.75,50.75 38.5,49 39.25,49 40,48.25 40,42.75 41,41.75 41,40 39.25,38.25 39.25,11.5 38.75,11 33.5,11 33.25,10.75 31,10.75 v30.5,10.25 | v24.75,14.5 24.75,14.15 R44.2 | TP11.TP v25.4,10.2
  Bottom 0.203: v30.5,10.25 26.5,10.25 26.07,10.68 | 26.07,10.68 25.5,11.25 25.5,13.75 v24.75,14.5 | v25.4,10.2 25.6,10.2 26.07,10.68
CH12_A  (via drill 0.4)
  Top 0.203: v31.75,12 31.15,12 C23.1
  Bottom 0.203: H2.12 41.94,22.19 v31.75,12
CH12_A_B  (via drill 0.4)
  Top 0.203: v28.75,49.75 28.75,44.75 28.5,44.5 28.5,40 v28.75,39.75 | 40.25,15 v40.5,14.75 39.75,15.5 39.75,37.5 v40.25,38 | R45.2 35.75,13.9 v35.75,14.25 35.3,14.7 TP12.TP
  Bottom 0.203: v28.75,39.75 29.5,39.75 30,39.25 31.25,39.25 31.75,39.75 39,39.75 40.25,38.5 v40.25,38 | v40.5,14.75 36.25,14.75 v35.75,14.25 | H10.12 31.25,56 32.25,55 32.25,53.25 v28.75,49.75
DGND
  Top 0.813: H1.15 H1.14 H1.13 H1.12
LEFT  (via drill 0.4)
  Top 0.203: R12.1 35.5,58.25 v36.25,57.5 | v38.25,54.75 37.02,54.75 U1.2 | H9.12 31.5,53.5 32.75,54.75 v32.75,57.25
  Top 0.61: H9.6 H9.7 | H9.9 H9.10
  Bottom 0.203: v32.75,57.25 36,57.25 v36.25,57.5 36.5,57.5 37.75,56.25 37.75,55.25 v38.25,54.75
  Bottom 0.61: H9.1 H9.2 H9.3 H9.4 H9.5 H9.6 | H9.7 H9.8 H9.9 | H9.10 H9.11 H9.12
N$1
  Top 0.406: C6.1 R7.1 24.9,46.35 T2.2
N$2
  Top 0.406: T1.2 15.55,45.9 | 15.55,45.9 R1.1 | C2.1 16,45.45 15.55,45.9
N$3
  Top 0.406: C1.2 11.8,43.85 R5.1 12,45.85 T1.1
N$4
  Top 0.305: R8.2 39.65,58.2 C3.2
  Top 0.406: C3.2 40.3,58 R9.2
N$5
  Top 0.203: R12.2 36.5,59.65 37.7,58.45 | 37.7,58.45 C3.1 | U1.1 36.95,57.7 37.7,58.45
N$6
  Top 0.203: U1.7 42.42,54.83 R13.2 42.9,55 43.75,55 43.75,53.25 42.75,52.25 41,52.25 40.25,51.5 C4.1
N$7
  Top 0.406: R2.1 14.5,43.65 C2.2
N$8  (via drill 0.4)
  Top 0.203: R11.2 34.84,53.3 R10.2 35.23,53.27 v35.25,53.25 | v37.75,51.25 38.15,51.25 C4.2
  Bottom 0.203: v35.25,53.25 37,53.25 38,52.25 38,51.5 v37.75,51.25
N$9
  Top 0.406: R6.1 25,43.65 C6.2
N$10
  Top 0.406: C5.2 20.65,42.15 22,43.5 22.35,43.5 R14.1 22.5,45.85 T2.1
N$11  (via drill 0.4)
  Top 0.203: C29.2 R4.2 8.1,41.15 8.88,40.38 | 8.88,40.38 9.25,40 10.25,40 11.25,41 11.25,41.6 R5.2 12.35,42 v12.5,42 | R3.1 6.65,37.15 v7.5,38 | v8.5,40 8.88,40.38 | 40.25,53.5 39.75,53.5 39.25,54 38,54 37.83,54.17 U1.3 | 40.25,53.5 41.02,53.5 U1.5 | v23.5,44.5 23.5,42.5 23.35,42.35 R14.2 22.5,41.75 v22.75,41.5 | 40.25,53.5 39.25,52.5 37.25,52.5 36.75,52 v36.75,51.75 | v38.25,41.5 38.25,41.75 38,42 38,48 37.5,48.5 37.25,48.5 v36.25,49.5
  Bottom 0.203: v7.5,38 7.5,39 v8.5,40 | v23.5,44.5 21,44.5 19,42.5 13,42.5 v12.5,42 | v22.75,41.5 v38.25,41.5 | v36.25,49.5 36.25,51.25 v36.75,51.75
N$12
  Top 0.406: T8.2 26.55,26.9 R18.1 C18.1
N$13
  Top 0.406: R33.1 26.8,22.85 C18.2
N$14
  Top 0.406: T3.2 36.55,45.9 R16.1 C8.1
N$15
  Top 0.203: R15.1 35.5,43.65 C8.2
  Top 0.406: 36.8,42.35 C8.2
N$16
  Top 0.203: 31.75,42.35 31.75,42.4 R17.1
  Top 0.406: C7.2 30.7,42.35 31.75,42.35 32,42.6 32,44.25 33.05,45.3 T3.1
N$18
  Top 0.406: T4.2 16.05,36.9 R35.1 C10.1
N$19
  Top 0.406: C10.2 14.7,33.15 R25.1
N$20
  Top 0.406: C9.2 12.45,34.6 R20.1 12.5,36.85 T4.1
N$22
  Top 0.406: C12.1 27.15,33.15 27.5,33.5 27.5,36.35 R36.1 24.9,37.35 T5.2
N$23
  Top 0.406: C12.2 24.7,34.85 R27.1
N$24
  Top 0.406: T5.1 22.55,34.7 R23.1 20.2,34.65 C11.2
N$26
  Top 0.203: C14.1 36.65,33.15 35.75,32.25 34.25,32.25 34,32.5 34,35.95 T6.2
  Top 0.406: R39.1 35.4,37.35 T6.2
N$27
  Top 0.406: R28.1 37.05,34.65 C14.2
N$28
  Top 0.406: R26.1 33,36.85 T6.1 32.55,36.9 C13.2
N$29  (via drill 0.4)
  Top 0.406: C51.1 29.35,4.4 30.25,3.5 32,3.5 32.5,4 32.5,6.25 31.75,7 30.6,7 R49.2
  Top 0.813: T13.1 25.45,4.7 v25.75,5 | v29,3.75 29,4.75 C51.1
  Bottom 0.813: v25.75,5 27.75,5 v29,3.75
N$30
  Top 0.406: T7.2 14.65,27.1 R38.1 C16.1
N$31
  Top 0.406: C16.2 14.7,22.65 R32.1
N$32
  Top 0.406: C15.2 12.3,24.35 R29.1 12.5,26.85 T7.1
N$33
  Top 0.813: U2.1 17.32,7.48 C52.1 17.65,6.9 16,5.25 16,3 17.25,1.75 23.5,1.75 24,2.25 24.35,2.25 T13.3 26.15,2.4 27.5,3.75 27.5,6 28.5,7 29.2,7 R49.1
N$34  (via drill 0.4)
  Top 0.203: v7.25,25.25 7.15,25.15 R31.2 R30.1 6.35,27.5 6,27.5 5.25,28.25 5.25,31.5 6.1,32.35 C46.2 8.9,32.35 9.75,31.5 10.65,31.5 R20.2 12.5,33.25 v13.5,32.25 | v12.5,22 R29.2 | R23.2 v22.5,32.75 23.5,31.75 v26.25,31.75 | R26.2 33,32.75 v32.75,32.5 33.5,31.75 38,31.75 38.25,32 38.25,39.25 v39.75,40.75 | R17.2 33,42 32.5,41.5 31.5,41.5 v30.75,40.75
  Bottom 0.203: v7.25,25.25 8.25,25.25 9,24.5 9,21.75 9.5,21.25 11.75,21.25 v12.5,22 | v13.5,32.25 22,32.25 v22.5,32.75 | v30.75,40.75 v39.75,40.75 | v32.75,32.5 31.5,32.5 31,32 26.5,32 v26.25,31.75
N$35
  Top 0.406: T8.1 23,26.85 R34.1 20.7,24.15 C17.2
N$36
  Top 0.406: T9.2 35.4,27.35 R19.1 37.25,27.1 C20.1
N$37
  Top 0.406: R41.1 37.05,22.85 C20.2
N$38
  Top 0.406: C19.2 32.8,24.35 R37.1 33,26.85 T9.1
N$40
  Top 0.406: C22.1 R21.1 14.5,16.35 T10.2
N$41
  Top 0.406: R42.1 16.3,12.35 C22.2
N$42
  Top 0.406: T10.1 12.5,16.35 R40.1 10.2,13.65 C21.2
N$44
  Top 0.406: T11.2 26.05,16.4 R24.1 C24.1
N$45
  Top 0.406: C24.2 24.7,12.4 R44.1
N$46
  Top 0.406: C25.2 22.3,14.1 R43.1 22.5,16.35 T11.1
N$48
  Top 0.406: C26.1 R22.1 35.5,16.35 T12.2
N$49
  Top 0.406: R45.1 37.3,12.35 C26.2
N$50
  Top 0.406: C23.2 33.3,13.85 R46.1 33.5,16.35 T12.1
N$52  (via drill 0.4)
  Top 0.203: R47.1 R48.2 7.85,17.15 8.75,16.25 8.75,15.6 C47.2 6.9,13.35 9.25,11 12,11 12.75,11.75 12.75,12.1 R40.2 12.5,12.25 14,10.75 19,10.75 19.5,11.25 | 19.5,11.25 21.15,11.25 R43.2 22.5,12 23.25,11.25 33,11.25 33.25,11.5 33.25,12.1 R46.2 | R34.2 23,22.25 v23.5,21.75 23,21.75 20.75,19.5 19.75,19.5 19.25,19 19.25,11.5 19.5,11.25 | v33,22.25 R37.2
  Bottom 0.203: v23.5,21.75 23.75,21.75 24.25,21.25 32,21.25 v33,22.25
RIGHT  (via drill 0.4)
  Top 0.203: R13.1 42.42,54.17 U1.6 40.98,54.25 40.25,54.25 39.75,54.75 39.75,56.5 39.5,56.75 v38.5,56.75
  Top 0.61: H11.9 H11.10
  Bottom 0.203: H11.12 37,58.5 37,58.25 v38.5,56.75
  Bottom 0.61: H11.1 H11.2 H11.3 H11.4 H11.5 H11.6 H11.7 H11.8 H11.9 | H11.10 H11.11 H11.12
STEREO_LEFT  (via drill 0.4)
  Top 0.406: R9.1 43.3,59.2 44,59.9 44,63 v43.75,63.25
  Bottom 0.203: H12.3 29.19,61.81 30.25,60.75 34.75,60.75 35.5,61.5 35.5,64.5 36,65 43,65 43.75,64.25 v43.75,63.25
STEREO_RIGHT
  Top 0.203: R11.1 33.54,59.46 31.75,61.25 31.75,62.98 H12.4

### Text on the board
tNames: CH9_A | CH10_A | LEFT | RIGHT | AGND | RIGHT | LEFT | CH1 | CH2 | CH3 | CH4 | CH5 | CH6 | CH7 | CH8 | CH9A | CH10A | +12V_REG | CH11A | CH12A | NC | DGND | NC | NC | NC | NC | AGND | NC | NC | NC | NC | v0.9
_tNames: H12 | CH9_A | CH10_A | LEFT | RIGHT | AGND | RIGHT | R8 | R9 | C3 | C30 | R12 | R11 | U1 | R10 | R13 | C4 | LEFT | CH1 | T1 | T2 | T3 | CH2 | C27 | R1 | C28 | R7 | C32 | R16 | CH3 | C5 | C29 | C1 | R2 | CH4 | R5 | C2 | R14 | R6 | C6 | C7 | R17 | R15 | C8 | TP1 | R4 | T4 | TP2 | TP3 | CH5 | T5 | C37 | T6 | CH6 | C34 | R35 | C36 | R36 | R39 | R3 | R26 | R28 | CH7 | C9 | R20 | R25 | C10 | C11 | R23 | R27 | C12 | C13 | C14 | CH8 | TP5 | TP4 | C46 | TP6 | CH9A | T7 | C41 | T8 | C42 | T9 | CH10A | R30 | C39 | R38 | R18 | R19 | +12V_REG | CH11A | R31 | R32 | C16 | C17 | R34 | R33 | C18 | C19 | R37 | C20 | CH12A | C15 | R29 | R41 | TP7 | TP8 | TP9 | NC | R47 | T11 | T10 | C44 | C45 | T12 | DGND | C43 | R24 | NC | R48 | R21 | R22 | TP12 | NC | C47 | C21 | R40 | R42 | C22 | C25 | R43 | R44 | C24 | C23 | R46 | R45 | C26 | NC | TP11 | TP10 | NC | U2 | C52 | C49 | R49 | C33 | AGND | NC | C48 | C53 | NC | T13 | C51 | NC | NC | v0.9